# EAGLE design WIFIAdapter (EAGLE 7.4.0)
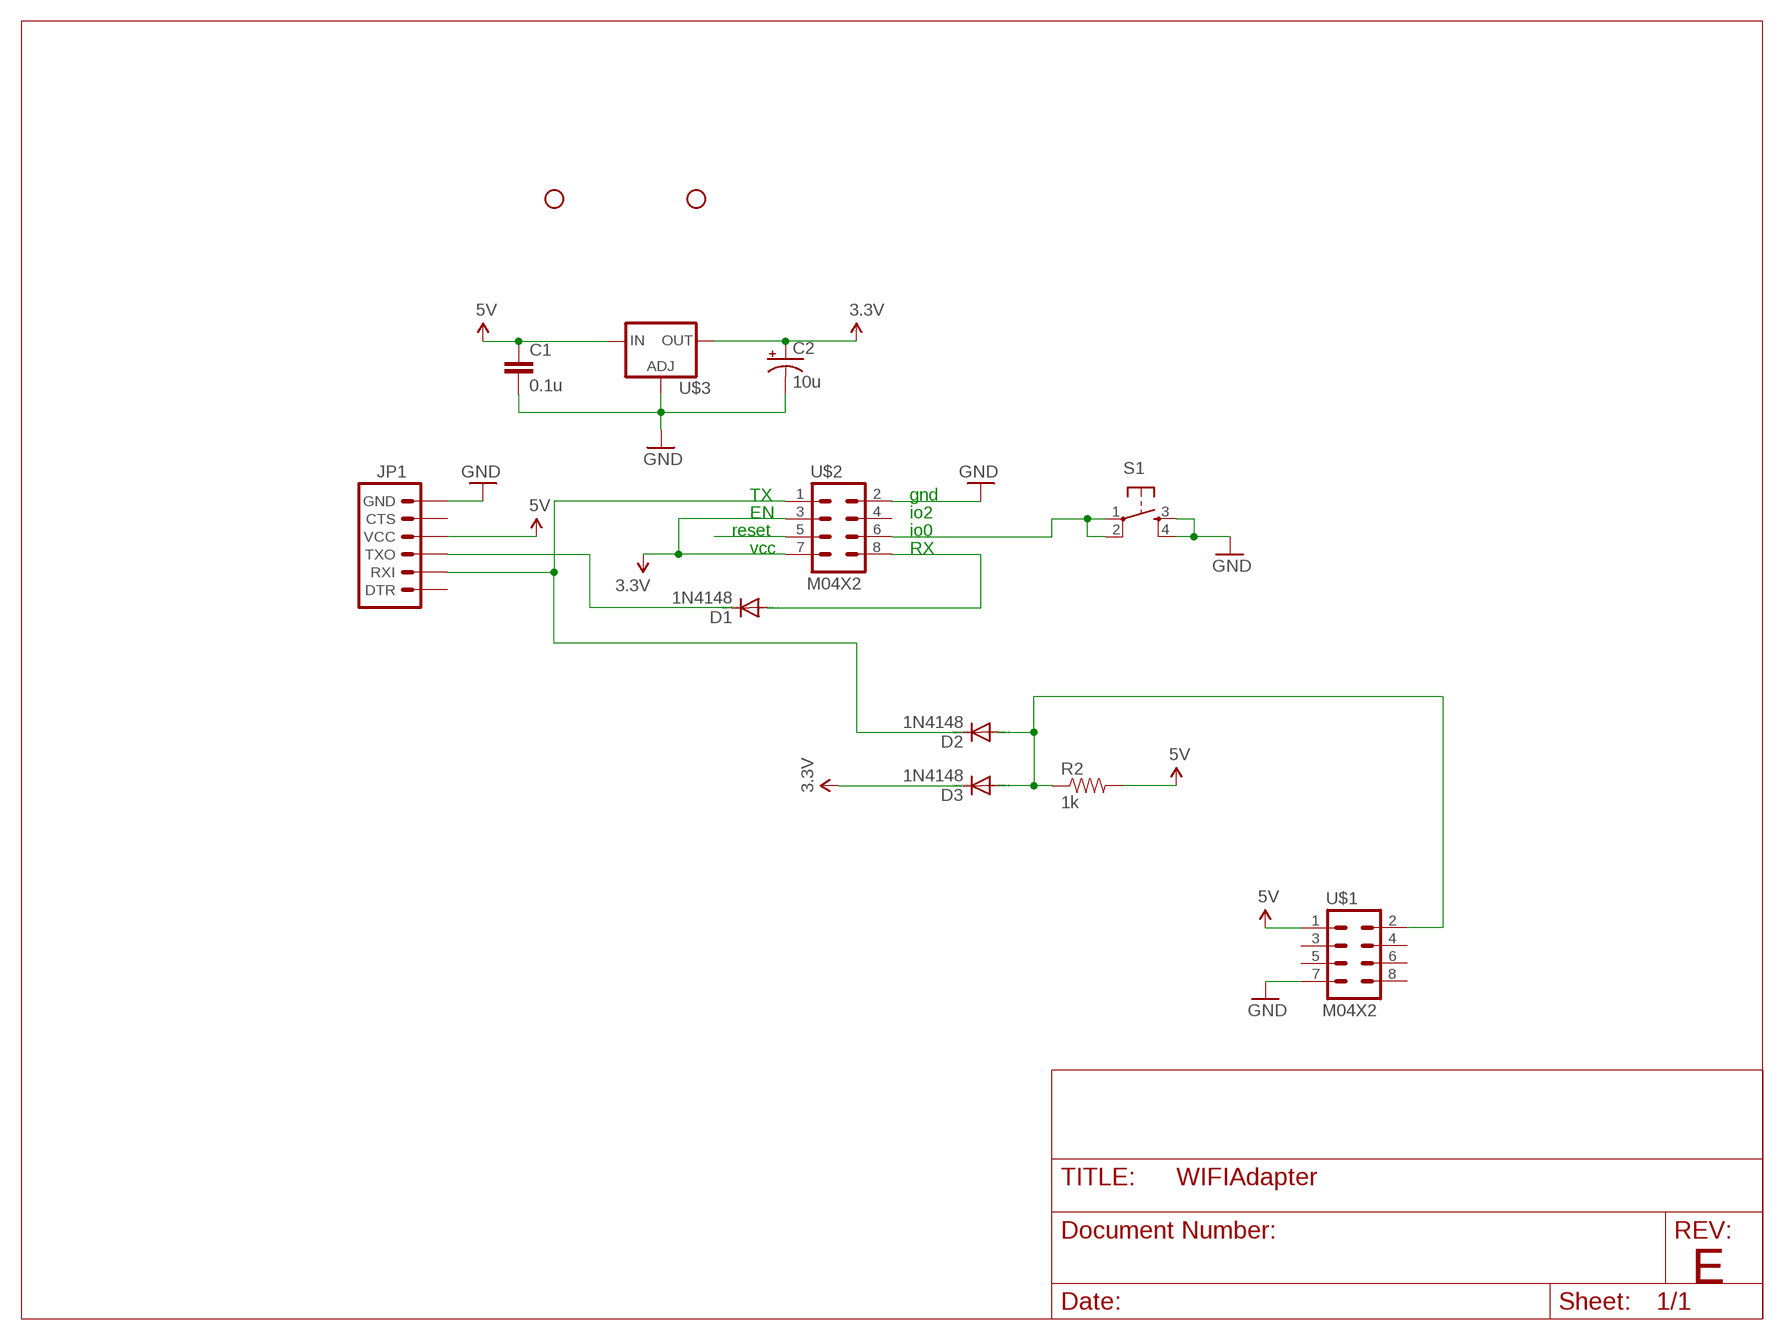
[diagram p0: schematic, sheet 1]

## Parts
C1  0.1u  CAPEZ  [CAP-PTH-SMALLEZ]
C2  10u  CAP_POLPTH2  [CPOL-RADIAL-10UF-25V]
D1  1N4148  1N4148DO35-7  [DO35-7]
D2  1N4148  1N4148DO35-7  [DO35-7]
D3  1N4148  1N4148DO35-7  [DO35-7]
JP1  ARDUINO_SERIAL_PROGRAMLOCK  [1X06_LOCK]
R2  1k  RESISTOREZ  [AXIAL-0.3EZ]
S1  TAC_SWITCHPTH  [TACTILE-PTH]
STANDOFF1  STAND-OFFTIGHT  [STAND-OFF-TIGHT]
STANDOFF2  STAND-OFFTIGHT  [STAND-OFF-TIGHT]
U$1  M04X2  [2X4]
U$2  M04X2  [2X4]
U$3  LM317TS  [317TS]

## Nets
3.3V: C2.1(+) D3.C U$2.3 U$2.7 U$3.2(OUT)
5V: C1.1 JP1.4(VCC) R2.P$2 U$1.1 U$3.3(IN)
GND: C1.2 C2.2(-) JP1.6(GND) S1.3 S1.4 U$1.7 U$2.2 U$3.1(ADJ)
N$3: U$2.5
N$7: S1.1 S1.2 U$2.6
N$8: D1.C JP1.3(TXO)
N$11: D2.A D3.A R2.P$1 U$1.2
RX: D1.A U$2.8
TX: D2.C JP1.2(RXI) U$2.1
Unconnected: JP1.1(DTR) JP1.5(CTS) U$1.3 U$1.4 U$1.5 U$1.6 U$1.8 U$2.4

## Notes on the sheet
- TX | gnd
- EN | io2
- reset | io0
- vcc | RX
- E

## Library data of the parts
C1 = SparkFun-Capacitors:CAP: Capacitor Standard 0603 ceramic capacitor, and 0.1" leaded capacitor.
C2 = SparkFun-Capacitors:CAP_POL: Capacitor Polarized These are standard SMD and PTH capacitors. Normally 10uF, 47uF, and 100uF in electrolytic and tantalum varieties. Always verify the external diameter of the through hole cap, it varies with capacity, voltage, and manufacturer. The EIA devices should be standard.
D1-D3 = diode:1N4148: DIODE high speed (Philips)
JP1 = SparkFun-Connectors:ARDUINO_SERIAL_PROGRAM: FTDI connector footprints
R2 = SparkFun-Resistors:RESISTOR: Resistor Basic schematic elements and footprints for 0603, 1206, and PTH resistors.
S1 = SparkFun-Electromechanical:TAC_SWITCH: Momentary Switch Button commonly used for reset or general input. Spark Fun Electronics SKU : COM-00097 SMT- SWCH-08247
STANDOFF1 STANDOFF2 = SparkFun-Electromechanical:STAND-OFF: #4 Stand Off This is the mechanical footprint for a #4 phillips button head screw. Use the keepout ring to avoid running the screw head into surrounding components. SKU : PRT-00447
U$1 U$2 = SparkFun-Connectors:M04X2: .1" header, two rows of four.
U$3 = v-reg:LM317TS: VOLTAGE REGULATOR

## Net classes
0 default: width 0.305 mm
1 PWR: width 0.508 mm

## Board
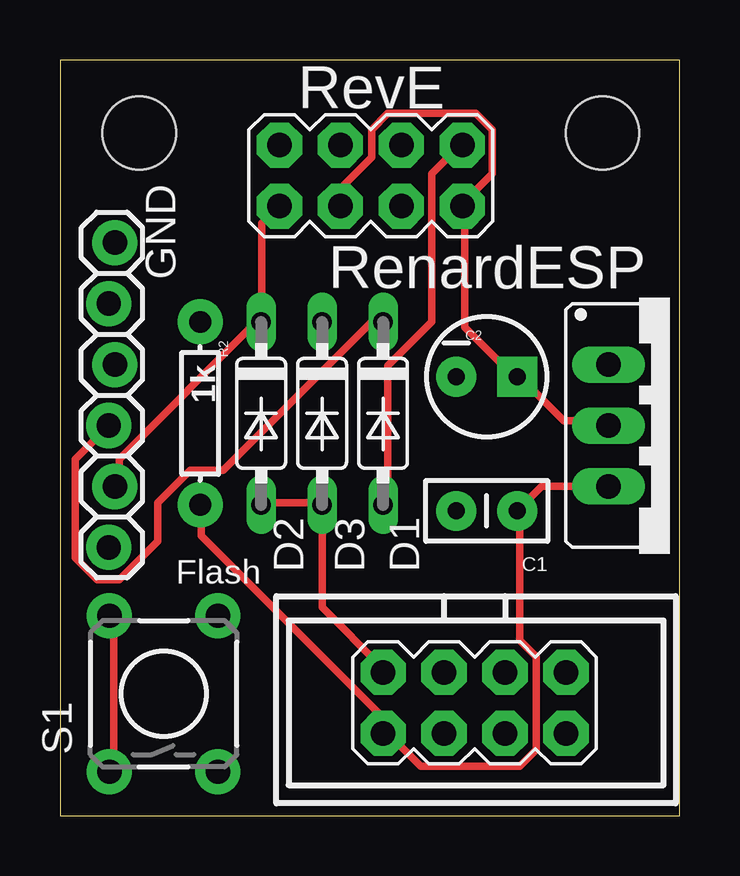
[diagram p1: board, top side]
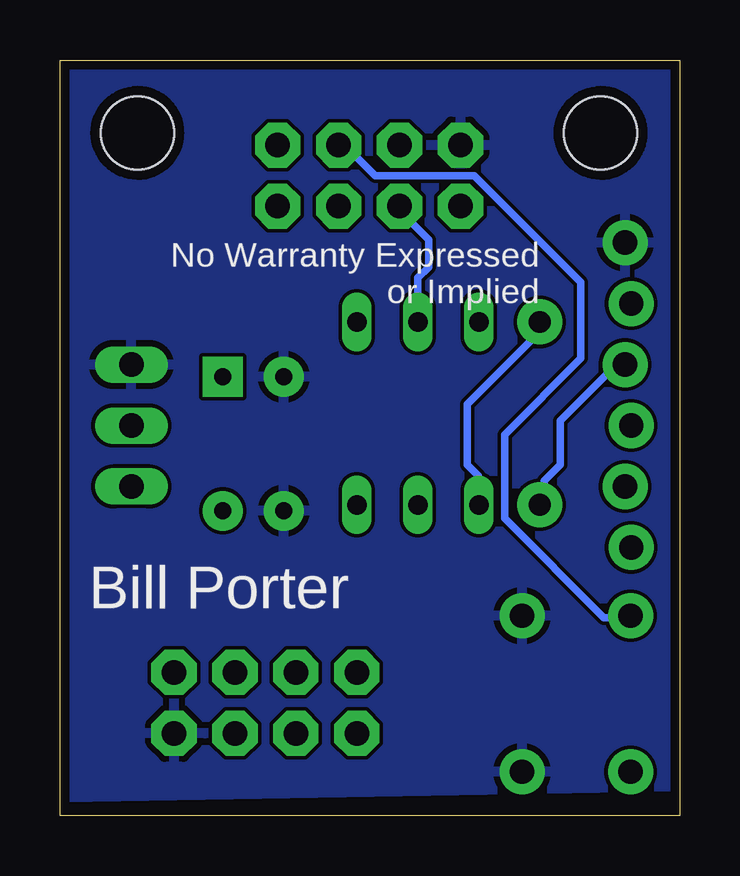
[diagram p2: board, bottom side, seen from below]

Size 25.83 x 31.49 mm. Coordinates in mm from the lower left corner, seen from the top.
Outline: 0,0 25.83,0 25.83,31.49 0,31.49 0,0
Copper layers (1*16): Top 0.0356mm / dielectric 1.5011mm / Bottom 0.0356mm
Design rules "oshpark-2layer": minimum track width 6mil, minimum drill 13mil, track to track 6mil, track to pad 6mil, pad to pad 6mil, via to via 6mil, smd to smd 6mil, copper to edge 15mil, drill to drill 6mil, minimum pad ring 7mil, minimum via ring 7mil, stop-mask expansion 4mil, vias tented up to drill 0mil, thermal gap 10mil

### Footprints (pad centres in the part's own frame; a part is rotated, then mirrored left to right if it is on the bottom)
CAP-PTH-SMALLEZ = drill 0.7 pad 1.651: 1 0,0; 2 2.54,0
CPOL-RADIAL-10UF-25V = drill 0.7 pad 1.651 square: 1 1.27,0 | drill 0.7 pad 1.651: 2 -1.27,0
DO35-7 = drill 0.813 long: A 3.81,0; C -3.81,0
1X06_LOCK = drill 1.016 pad 1.88: 1 0,0; 2 2.54,-0.254; 3 5.08,0; 4 7.62,-0.254; 5 10.16,0; 6 12.7,-0.254
AXIAL-0.3EZ = drill 0.9 pad 1.88: P$1 -3.81,0; P$2 3.81,0
TACTILE-PTH = drill 1.016 pad 1.88: 1 -3.251,2.261; 2 3.251,2.261; 3 -3.251,-2.261; 4 3.251,-2.261
STAND-OFF-TIGHT = hole 3.048: 0,0
2X4 = drill 1.016 pad 1.88 octagon: 1 -3.81,-1.27; 2 -3.81,1.27; 3 -1.27,-1.27; 4 -1.27,1.27; 5 1.27,-1.27; 6 1.27,1.27; 7 3.81,-1.27; 8 3.81,1.27
317TS = drill 1.016 long: 1 -2.54,-2.54; 2 0,-2.54; 3 2.54,-2.54

### Placement (x,y rotation side)
C1  19.05,12.7 180 top
C2  17.78,18.29 0 top
D1  13.46,16.76 270 top
D2  8.38,16.76 270 top
D3  10.92,16.76 270 top
JP1  2.03,11.18 90 top
R2  5.84,16.76 270 top
S1  4.32,5.08 90 top
STANDOFF1  22.61,28.45 0 top
STANDOFF2  3.3,28.45 0 top
U$1  17.27,4.7 0 top
U$2  12.95,26.67 0 top
U$3  25.4,16.26 270 top

### Tracks (layer width: path | path; a pad name or v marks a point on that pad's centre or on a via)
3.3V
  Top 0.305: U$3.2 22.81,16.46 20.98,16.46 19.15,18.29 C2.1 18.92,18.29 16.87,20.34 16.87,25.38 U$2.7 16.87,25.6 18.01,26.75 18.01,28.58 17.32,29.26 13.66,29.26 12.98,28.58 12.98,27.43 11.84,26.29 11.84,25.6 U$2.3
  Bottom 0.305: D3.C 10.92,22.4 10.47,22.86 10.47,24 11.84,25.38 U$2.3
5V
  Top 0.305: U$3.3 20.07,13.72 C1.1 19.15,12.57 19.15,7.32 19.84,6.63 19.84,2.74 19.15,2.06 15.04,2.06 13.66,3.43 U$1.1 13.44,3.43 13.44,4.12 5.89,11.66 5.89,12.8 R2.P$2
  Bottom 0.305: JP1.4 2.46,18.74 2.69,18.74 4.98,16.46 4.98,14.63 5.66,13.95 5.66,13.03 R2.P$2
GND
  pour Bottom: -2.54,38.1 25.65,37.59 25.65,0.76 -2.54,1.27
N$7
  Top 0.305: S1.1 2.23,1.83 2.23,8.23 S1.2
  Bottom 0.305: U$2.6 13.97,27.94 12.7,26.67 8.57,26.67 4.13,22.23 4.13,19.05 7.3,15.88 7.3,12.38 3.18,8.25 2.22,8.25 S1.2
N$8
  Top 0.305: D1.C 12.98,20.57 6.81,14.4 5.44,14.4 4.06,13.03 4.06,11.43 2.46,9.83 1.55,9.83 0.64,10.74 0.64,14.86 JP1.3
N$11
  Top 0.305: D2.A 8.41,13.03 10.92,13.03 D3.A 10.92,8.69 13.44,6.17 U$1.2
  Bottom 0.305: R2.P$1 5.89,20.57 5.89,20.12 8.87,17.15 8.87,14.63 8.41,14.17 8.41,13.03 D2.A
RX
  Top 0.305: D1.A 13.66,13.03 13.66,18.74 15.49,20.57 15.49,26.75 16.64,27.89 U$2.8
TX
  Top 0.305: U$2.1 9.09,25.38 8.41,24.69 8.41,20.57 D2.C 8.18,20.57 2.46,14.86 2.46,13.72 JP1.2

### Text on the board
tPlace: RevE
tNames: GND | RenardESP | Flash
bNames: No Warranty Expressed / or Implied | Bill Porter